# EAGLE schematic WaveAnalysisBoard (EAGLE 9.6.2)

## Sheet 1 of 2: Audio & Power
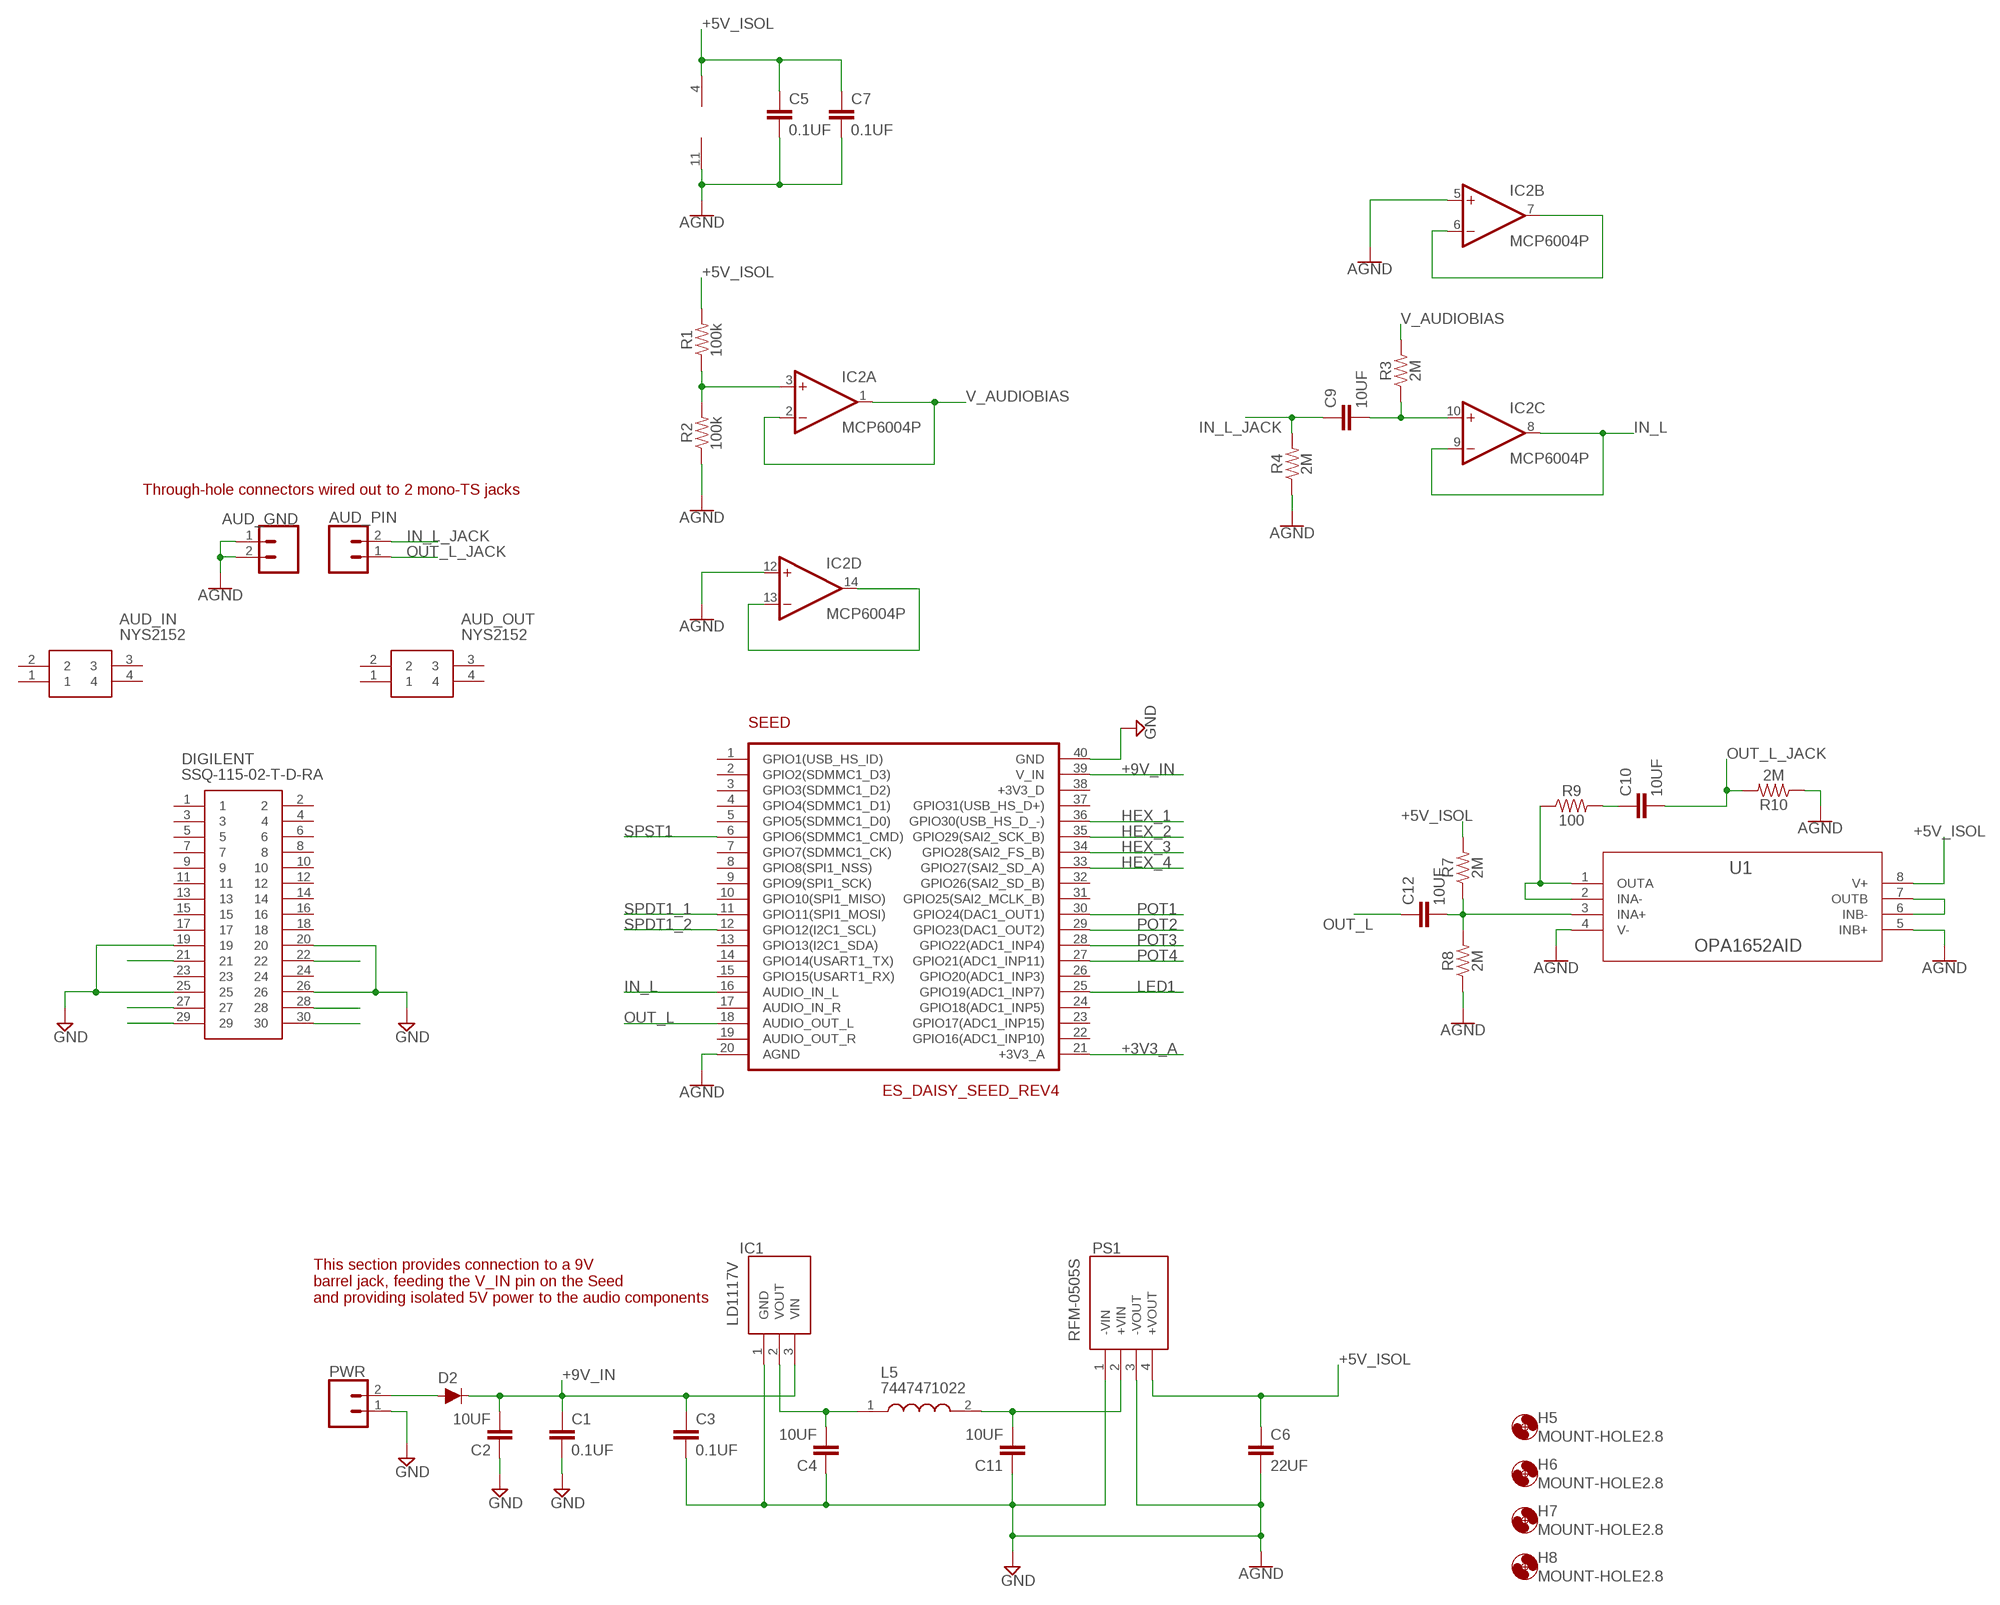
[diagram p0: schematic, sheet 1]

### Parts
AUD_GND  CONN_02  [1X02]
AUD_IN  NYS2152  [NYS2152]
AUD_OUT  NYS2152  [NYS2152]
AUD_PIN  CONN_02  [1X02]
C1  0.1UF  [CAP-PTH-SMALL-KIT]
C2  10UF  [CAP-PTH-SMALL-KIT]
C3  0.1UF  [CAP-PTH-SMALL-KIT]
C4  10UF  [CAP-PTH-SMALL-KIT]
C5  0.1UF  [CAP-PTH-SMALL-KIT]
C6  22UF  [CAP-PTH-SMALL-KIT]
C7  0.1UF  [CAP-PTH-SMALL-KIT]
C9  10UF  [CAP-PTH-SMALL-KIT]
C10  10UF  [CAP-PTH-SMALL-KIT]
C11  10UF  [CAP-PTH-SMALL-KIT]
C12  10UF  [CAP-PTH-SMALL-KIT]
D2  200mA/100V/1V  DIODE-1N4148  [DIODE-1N4148]
DIGILENT  SSQ-115-02-T-D-RA  [RHDRRA30W64P254_2X15_3861X851X]
H5  MOUNT-HOLE2.8  [2,8]
H6  MOUNT-HOLE2.8  [2,8]
H7  MOUNT-HOLE2.8  [2,8]
H8  MOUNT-HOLE2.8  [2,8]
IC1  LD1117V  [TO255P460X1020X2008-3P]
IC2  MCP6004P  [DIL14]
L5  7447471022  [WE-TIS_111190]
PS1  RFM-0505S  [RFM0505S]
PWR  CONN_02  [1X02]
R1  100k  100KOHM-HORIZ-1/4W-5%  [AXIAL-0.3]
R2  100k  100KOHM-HORIZ-1/4W-5%  [AXIAL-0.3]
R3  2M  2MOHM-HORIZ-1/4W-5%  [AXIAL-0.3]
R4  2M  2MOHM-HORIZ-1/4W-5%  [AXIAL-0.3]
R7  2M  2MOHM-HORIZ-1/4W-5%  [AXIAL-0.3]
R8  2M  2MOHM-HORIZ-1/4W-5%  [AXIAL-0.3]
R9  100  100OHM-HORIZ-1/4W-1%  [AXIAL-0.3]
R10  2M  2MOHM-HORIZ-1/4W-5%  [AXIAL-0.3]
SEED  ES_DAISY_SEED_REV4  [ES_DAISY_SEED]
U1  OPA1652AID  [D8]

### Nets
+3V3_A: SEED.21(+3V3_A) ; also sheet 2
+5V_ISOL: C5.1 C6.1 C7.1 IC2.4(P:V+) PS1.4(+VOUT) R1.P$2 R7.P$2 U1.8(V+)
+9V_IN: C1.1 C2.2 C3.1 D2.C IC1.3(VIN) SEED.39(V_IN)
AGND: AUD_GND.1 AUD_GND.2 C3.2 C4.1 C5.2 C6.2 C7.2 C11.1 IC1.1(GND) IC2.5(B:+IN) IC2.11(P:V-) IC2.12(D:+IN) PS1.1(-VIN) PS1.3(-VOUT) R2.P$1 R4.P$1 R8.P$1 R10.P$1 SEED.20(AGND) U1.4(V-) U1.5(INB+) ; supply symbol labelled GND
GND: C1.2 C2.1 DIGILENT.19 DIGILENT.20 DIGILENT.25 DIGILENT.26 PWR.1 SEED.40(GND) ; also sheet 2
HEX_1: SEED.36(GPIO30(USB_HS_D_-)) ; also sheet 2
HEX_2: SEED.35(GPIO29(SAI2_SCK_B)) ; also sheet 2
HEX_3: SEED.34(GPIO28(SAI2_FS_B)) ; also sheet 2
HEX_4: SEED.33(GPIO27(SAI2_SD_A)) ; also sheet 2
IN_L: IC2.8(C:OUT) IC2.9(C:-IN) SEED.16(AUDIO_IN_L)
IN_L_JACK: AUD_PIN.2 C9.1 R4.P$2
LED1: SEED.25(GPIO19(ADC1_INP7)) ; also sheet 2
N$2: D2.A PWR.2
N$6: IC2.3(A:+IN) R1.P$1 R2.P$2
N$7: C11.2 L5.2 PS1.2(+VIN)
N$8: C4.2 IC1.2(VOUT) L5.1
N$9: C9.2 IC2.10(C:+IN) R3.P$1
N$10: IC2.13(D:-IN) IC2.14(D:OUT)
N$11: DIGILENT.21
N$12: C12.2 R7.P$1 R8.P$2 U1.3(INA+)
N$13: R9.P$1 U1.1(OUTA) U1.2(INA-)
N$14: C10.1 R9.P$2
N$15: U1.6(INB-) U1.7(OUTB)
N$16: DIGILENT.22
N$17: DIGILENT.28
N$18: IC2.6(B:-IN) IC2.7(B:OUT)
N$19: DIGILENT.30
N$20: DIGILENT.27
N$21: DIGILENT.29
OUT_L: C12.1 SEED.18(AUDIO_OUT_L)
OUT_L_JACK: AUD_PIN.1 C10.2 R10.P$2
POT1: SEED.30(GPIO24(DAC1_OUT1)) ; also sheet 2
POT2: SEED.29(GPIO23(DAC1_OUT2)) ; also sheet 2
POT3: SEED.28(GPIO22(ADC1_INP4)) ; also sheet 2
POT4: SEED.27(GPIO21(ADC1_INP11)) ; also sheet 2
SPDT1_1: SEED.11(GPIO11(SPI1_MOSI)) ; also sheet 2
SPDT1_2: SEED.12(GPIO12(I2C1_SCL)) ; also sheet 2
SPST1: SEED.6(GPIO6(SDMMC1_CMD)) ; also sheet 2
V_AUDIOBIAS: IC2.1(A:OUT) IC2.2(A:-IN) R3.P$2
Unconnected: AUD_IN.1 AUD_IN.2 AUD_IN.3 AUD_IN.4 AUD_OUT.1 AUD_OUT.2 AUD_OUT.3 AUD_OUT.4 DIGILENT.1 DIGILENT.2 DIGILENT.3 DIGILENT.4 DIGILENT.5 DIGILENT.6 DIGILENT.7 DIGILENT.8 DIGILENT.9 DIGILENT.10 DIGILENT.11 DIGILENT.12 DIGILENT.13 DIGILENT.14 DIGILENT.15 DIGILENT.16 DIGILENT.17 DIGILENT.18 DIGILENT.23 DIGILENT.24 SEED.1(GPIO1(USB_HS_ID)) SEED.2(GPIO2(SDMMC1_D3)) SEED.3(GPIO3(SDMMC1_D2)) SEED.4(GPIO4(SDMMC1_D1)) SEED.5(GPIO5(SDMMC1_D0)) SEED.7(GPIO7(SDMMC1_CK)) SEED.8(GPIO8(SPI1_NSS)) SEED.9(GPIO9(SPI1_SCK)) SEED.10(GPIO10(SPI1_MISO)) SEED.13(GPIO13(I2C1_SDA)) SEED.14(GPIO14(USART1_TX)) SEED.15(GPIO15(USART1_RX)) SEED.17(AUDIO_IN_R) SEED.19(AUDIO_OUT_R) SEED.22(GPIO16(ADC1_INP10)) SEED.23(GPIO17(ADC1_INP15)) SEED.24(GPIO18(ADC1_INP5)) SEED.26(GPIO20(ADC1_INP3)) SEED.31(GPIO25(SAI2_MCLK_B)) SEED.32(GPIO26(SAI2_SD_B)) SEED.37(GPIO31(USB_HS_D+)) SEED.38(+3V3_D)

### Notes on the sheet
- Through-hole connectors wired out to 2 mono-TS jacks
- This section provides connection to a 9V
  barrel jack, feeding the V_IN pin on the Seed 
  and providing isolated 5V power to the audio components

## Sheet 2 of 2: I/O
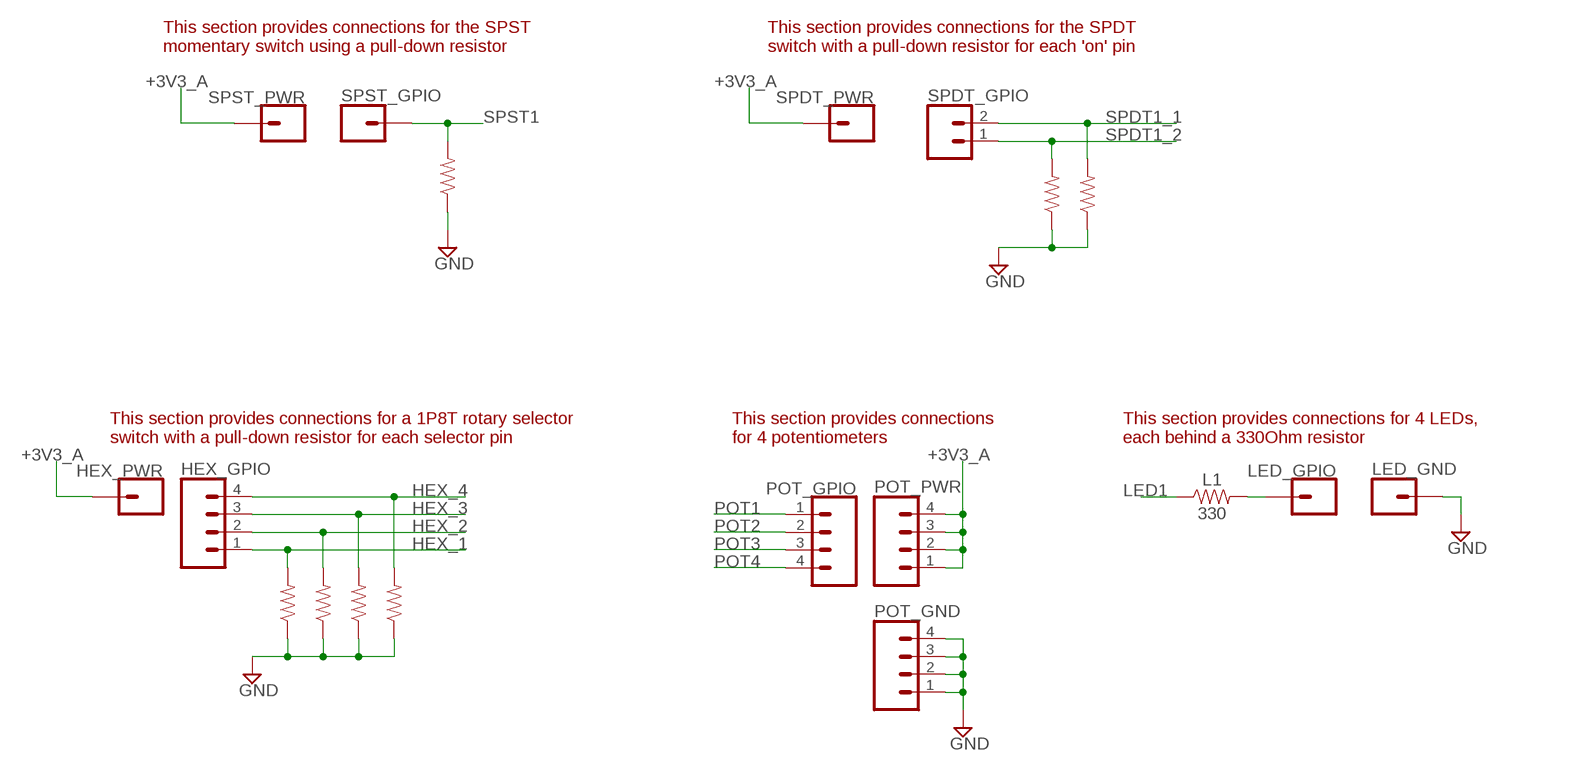
[diagram p1: schematic, sheet 2]

### Parts
D11  10k  10KOHM-HORIZ-1/4W-5%  [AXIAL-0.3]
D12  10k  10KOHM-HORIZ-1/4W-5%  [AXIAL-0.3]
H1  10k  10KOHM-HORIZ-1/4W-5%  [AXIAL-0.3]
H2  10k  10KOHM-HORIZ-1/4W-5%  [AXIAL-0.3]
H3  10k  10KOHM-HORIZ-1/4W-5%  [AXIAL-0.3]
H4  10k  10KOHM-HORIZ-1/4W-5%  [AXIAL-0.3]
HEX_GPIO  CONN_04  [1X04]
HEX_PWR  CONN_01  [1X01]
L1  330  330OHM-HORIZ-1/10W-5%  [AXIAL-0.3]
LED_GND  CONN_01  [1X01]
LED_GPIO  CONN_01  [1X01]
POT_GND  CONN_04  [1X04]
POT_GPIO  CONN_04  [1X04]
POT_PWR  CONN_04  [1X04]
S1  10k  10KOHM-HORIZ-1/4W-5%  [AXIAL-0.3]
SPDT_GPIO  CONN_02  [1X02]
SPDT_PWR  CONN_01  [1X01]
SPST_GPIO  CONN_01  [1X01]
SPST_PWR  CONN_01  [1X01]

### Nets
+3V3_A: HEX_PWR.1 POT_PWR.1 POT_PWR.2 POT_PWR.3 POT_PWR.4 SPDT_PWR.1 SPST_PWR.1 ; also sheet 1
GND: D11.P$1 D12.P$1 H1.P$1 H2.P$1 H3.P$1 H4.P$1 LED_GND.1 POT_GND.1 POT_GND.2 POT_GND.3 POT_GND.4 S1.P$1 ; also sheet 1
HEX_1: H1.P$2 HEX_GPIO.1 ; also sheet 1
HEX_2: H2.P$2 HEX_GPIO.2 ; also sheet 1
HEX_3: H3.P$2 HEX_GPIO.3 ; also sheet 1
HEX_4: H4.P$2 HEX_GPIO.4 ; also sheet 1
LED1: L1.P$1 ; also sheet 1
N$1: L1.P$2 LED_GPIO.1
POT1: POT_GPIO.1 ; also sheet 1
POT2: POT_GPIO.2 ; also sheet 1
POT3: POT_GPIO.3 ; also sheet 1
POT4: POT_GPIO.4 ; also sheet 1
SPDT1_1: D11.P$2 SPDT_GPIO.2 ; also sheet 1
SPDT1_2: D12.P$2 SPDT_GPIO.1 ; also sheet 1
SPST1: S1.P$2 SPST_GPIO.1 ; also sheet 1

### Notes on the sheet
- This section provides connections for the SPST 
  momentary switch using a pull-down resistor
- This section provides connections for the SPDT 
  switch with a pull-down resistor for each 'on' pin
- This section provides connections for a 1P8T rotary selector
  switch with a pull-down resistor for each selector pin
- This section provides connections
  for 4 potentiometers
- This section provides connections for 4 LEDs,
  each behind a 330Ohm resistor

## Library data of the parts
AUD_GND AUD_PIN PWR SPDT_GPIO = SparkFun-Connectors:CONN_02: Multi connection point. Often used as Generic Header-pin footprint for 0.1 inch spaced/style header connections On any of the 0.1 inch spaced packages, you can populate with these: Break Away Headers - Straight <https://www.sparkfun.com/products/116> (PRT-00116) Break Away Male Headers - Right Angle <https://www.sparkfun.com/products/553> (PRT-00553) Female Headers <https://www.sparkfun.com/products/115> (PRT-00115) Break Away Headers - Machine Pin <https://www.sparkfun.com/products/117> (PRT-00117) Break Away Female Headers - Swiss Machine Pin <https://www.sparkfun.com/products/743> (PRT-00743) For SCREWTERMINALS and SPRING TERMINALS visit here: Screw Terimnals on SparkFun.com <https://www.sparkfun.com/search/results?term=Screw+Terminals> (5mm/3.5mm/2.54mm spacing) This device is also useful as a general connection point to wire up your design to another part of your project. Our various solder wires solder well into these plated through hole pads. Hook-Up Wire - Assortment (Stranded, 22 AWG) <https://www.sparkfun.com/products/11375> (PRT-11375) Hook-Up Wire - Assortment (Solid Core, 22 AWG) <https://www.sparkfun.com/products/11367> (PRT-11367) View the entire wire category on our website here <https://www.sparkfun.com/categories/141> Special notes: Molex polarized connector foot print use with: PRT-08233 with associated crimp pins and housings. 2.54_SCREWTERM for use with PRT-10571. 3.5mm Screw Terminal footprints for PRT-08084 5mm Screw Terminal footprints for use with PRT-08432
AUD_IN AUD_OUT = SamacSys_Parts:NYS2152: Phone Connectors 1/4" MONO SWITCHED WITH CHROME NUT REAN Source: Datasheet; DESCRIPTION: Phone Connectors 1/4" MONO SWITCHED WITH CHROME NUT REAN; HEIGHT: 15.85mm; MANUFACTURER_NAME: Neutrik; MANUFACTURER_PART_NUMBER: NYS2152; MOUSER_PART_NUMBER: 568-NYS215/2; MOUSER_PRICE-STOCK: https://www.mouser.co.uk/ProductDetail/REAN/NYS2152?qs=jCymNF74TgWZcUJoC7KZ1g%3D%3D
C1 C3 C5 C7 = Custom-Parts:0.1UF
C2 C4 C9-C12 = Custom-Parts:10UF
C6 = Custom-Parts:22UF
D2 = SparkFun-DiscreteSemi:DIODE: Diode These are standard reverse protection diodes and small signal diodes. SparkFun Products: SparkFun SparkPunk Sound Kit <https://www.sparkfun.com/products/11177> SparkFun ESP8266 Thing <https://www.sparkfun.com/products/13231>; PROD_ID: DIO-08378
D11 D12 H1-H4 S1 = SparkFun-Resistors:10KOHM: 10kΩ resistor A resistor is a passive two-terminal electrical component that implements electrical resistance as a circuit element. Resistors act to reduce current flow, and, at the same time, act to lower voltage levels within circuits. - Wikipedia; PROD_ID: RES-09435
DIGILENT = SamacSys_Parts:SSQ-115-02-T-D-RA: CONN RECEPTACLE, 2.54MM, R/A DUAL 30WAY Source: Datasheet <http://suddendocs.samtec.com/catalog_english/ssq_th.pdf>; DESCRIPTION: CONN RECEPTACLE, 2.54MM, R/A DUAL 30WAY; HEIGHT: 4.95mm; MANUFACTURER_NAME: SAMTEC; MANUFACTURER_PART_NUMBER: SSQ-115-02-T-D-RA; MOUSER_PART_NUMBER: 200-SSQ11502TDRA; MOUSER_PRICE-STOCK: https://www.mouser.co.uk/ProductDetail/Samtec/SSQ-115-02-T-D-RA?qs=rU5fayqh%252BE2UN30xyNQdAQ%3D%3D
H5-H8 = holes:MOUNT-HOLE: MOUNTING HOLE with drill center marker
HEX_GPIO POT_GND POT_GPIO POT_PWR = SparkFun-Connectors:CONN_04: Multi connection point. Often used as Generic Header-pin footprint for 0.1 inch spaced/style header connections On any of the 0.1 inch spaced packages, you can populate with these: Break Away Headers - Straight <https://www.sparkfun.com/products/116> (PRT-00116) Break Away Male Headers - Right Angle <https://www.sparkfun.com/products/553> (PRT-00553) Female Headers <https://www.sparkfun.com/products/115> (PRT-00115) Break Away Headers - Machine Pin <https://www.sparkfun.com/products/117> (PRT-00117) Break Away Female Headers - Swiss Machine Pin <https://www.sparkfun.com/products/743> (PRT-00743) For SCREWTERMINALS and SPRING TERMINALS visit here: Screw Terimnals on SparkFun.com <https://www.sparkfun.com/search/results?term=Screw+Terminals> (5mm/3.5mm/2.54mm spacing) This device is also useful as a general connection point to wire up your design to another part of your project. Our various solder wires solder well into these plated through hole pads. Hook-Up Wire - Assortment (Stranded, 22 AWG) <https://www.sparkfun.com/products/11375> (PRT-11375) Hook-Up Wire - Assortment (Solid Core, 22 AWG) <https://www.sparkfun.com/products/11367> (PRT-11367) View the entire wire category on our website here <https://www.sparkfun.com/categories/141> Special notes: Molex polarized connector foot print use with SKU : PRT-08231 with associated crimp pins and housings. 1MM SMD Version SKU: PRT-10208; PROD_ID: CONN-09696
HEX_PWR LED_GND LED_GPIO SPDT_PWR SPST_GPIO SPST_PWR = SparkFun-Connectors:CONN_01: Single connection point. Often used as Generic Header-pin footprint for 0.1 inch spaced/style header connections On any of the 0.1 inch spaced packages, you can populate with these: Break Away Headers - Straight <https://www.sparkfun.com/products/116> (PRT-00116) Break Away Male Headers - Right Angle <https://www.sparkfun.com/products/553> (PRT-00553) Female Headers <https://www.sparkfun.com/products/115> (PRT-00115) Break Away Headers - Machine Pin <https://www.sparkfun.com/products/117> (PRT-00117) Break Away Female Headers - Swiss Machine Pin <https://www.sparkfun.com/products/743> (PRT-00743) This device is also useful as a general connection point to wire up your design to another part of your project. Our various solder wires solder well into these plated through hole pads. Hook-Up Wire - Assortment (Stranded, 22 AWG) <https://www.sparkfun.com/products/11375> (PRT-11375) Hook-Up Wire - Assortment (Solid Core, 22 AWG) <https://www.sparkfun.com/products/11367> (PRT-11367) View the entire wire category on our website here <https://www.sparkfun.com/categories/141> Special notes: SMTSO-256-ET is a "flush mount" nut for a 4-40 screw. We mostly use this on specialty testbeds; it is a nice way to connect hardware to your PCB at an adjustable hieght. Also note, the SNAP packages are for using a snappable style connector. We sell a baggie of snaps and they are also used on two LilyPad designs: Snap Assortment - 30 pack (male and female) <https://www.sparkfun.com/products/11347> (DEV-11347) LilyPad Arduino SimpleSnap <https://www.sparkfun.com/products/10941> (DEV-10941) LilyPad SimpleSnap Protoboard <https://www.sparkfun.com/products/10940> (DEV-10940)
IC1 = SamacSys_Parts:LD1117V: I.C. LD1117V Source: Datasheet <https://www.mouser.com/datasheet/2/389/ld1117-974075.pdf>; ARROW_PART_NUMBER: LD1117V; ARROW_PRICE-STOCK: https://www.arrow.com/en/products/ld1117v/stmicroelectronics; DESCRIPTION: I.C. LD1117V; HEIGHT: 4.6mm; MANUFACTURER_NAME: STMicroelectronics; MANUFACTURER_PART_NUMBER: LD1117V; MOUSER_PART_NUMBER: 511-LD1117V; MOUSER_PRICE-STOCK: https://www.mouser.co.uk/ProductDetail/STMicroelectronics/LD1117V?qs=tZUCD5p2VWqhC74a4KMNzA%3D%3D
IC2 = Custom-Parts:MCP6004: Quad Op Amp 2.7V to 6.0V Single Supply CMOS Source: https://www.mouser.com/datasheet/2/268/21733e-41017.pdf
L1 = SparkFun-Resistors:330OHM: 330Ω resistor A resistor is a passive two-terminal electrical component that implements electrical resistance as a circuit element. Resistors act to reduce current flow, and, at the same time, act to lower voltage levels within circuits. - Wikipedia; PROD_ID: RES-8371
L5 = SamacSys_Parts:7447471022: Wurth 2.2 uH +/-20% Ferrite Leaded Inductor, Max SRF:75MHz, 10A Idc, 0.009 Rdc WE-TIS Source: Datasheet <https://componentsearchengine.com/Datasheets/1/7447471022.pdf>; DESCRIPTION: Wurth 2.2 uH +/-20% Ferrite Leaded Inductor, Max SRF:75MHz, 10A Idc, 0.009 Rdc WE-TIS; HEIGHT: mm; MANUFACTURER_NAME: Wurth Elektronik; MANUFACTURER_PART_NUMBER: 7447471022; MOUSER_PART_NUMBER: 710-7447471022; MOUSER_PRICE-STOCK: https://www.mouser.com/Search/Refine.aspx?Keyword=710-7447471022
PS1 = SamacSys_Parts:RFM-0505S: RECOM POWER - RFM-0505S - DC-DC CONVERTER, 5V, 0.2A Source: Datasheet <https://www.recom-power.com/pdf/Econoline/RFM.pdf>; DESCRIPTION: RECOM POWER - RFM-0505S - DC-DC CONVERTER, 5V, 0.2A; HEIGHT: 10.5mm; MANUFACTURER_NAME: RECOM Power; MANUFACTURER_PART_NUMBER: RFM-0505S; MOUSER_PART_NUMBER: 919-RFM-0505S; MOUSER_PRICE-STOCK: https://www.mouser.co.uk/ProductDetail/RECOM-Power/RFM-0505S?qs=lYGu3FyN48dRVYKTH5ipqg%3D%3D
R1 R2 = SparkFun-Resistors:100KOHM: 100kΩ resistor A resistor is a passive two-terminal electrical component that implements electrical resistance as a circuit element. Resistors act to reduce current flow, and, at the same time, act to lower voltage levels within circuits. - Wikipedia; PROD_ID: RES-10686
R3 R4 R7 R8 R10 = Custom-Parts:2MOHM: 2MΩ resistor A resistor is a passive two-terminal electrical component that implements electrical resistance as a circuit element. Resistors act to reduce current flow, and, at the same time, act to lower voltage levels within circuits. - Wikipedia; PROD_ID: RES-09329
R9 = SparkFun-Resistors:100OHM: 100Ω resistor A resistor is a passive two-terminal electrical component that implements electrical resistance as a circuit element. Resistors act to reduce current flow, and, at the same time, act to lower voltage levels within circuits. - Wikipedia; PROD_ID: RES-12181
SEED = Electrosmith-Boards:ES_DAISY_SEED_REV4; IPN: Daisy Seed
U1 = Custom-Parts:OPA1652AID; DATASHEET_URL: http://www.ti.com/lit/gpn/OPA1652; DESCRIPTION: Sound Plus Low Noise and Distortion, General-Purpose, FET-Input Audio Op Amps; FAMILY_NAME: LOW NOISE; GENERIC_PART_NUMBER: OPA1652; INDUSTRY_STD_PKG_TYPE: SOIC; MANUFACTURER: Texas Instruments; MANUFACTURER_PART_NUMBER: OPA1652AID; PACKAGE_DESIGNATOR: D; PIN_COUNT: 8; VENDOR: Texas Instruments

## Net classes
0 DEFAULT: width 0.102 mm, drill 0.2 mm, clearance 0.102 mm